# Altium schematic sheet IO MAPPING - Pin Map.SchDoc: IO MAPPING - Pin Map and switches
size A3; Organization: Tekt Industries; DocumentNumber: 2; Revision: A.01; SheetNumber: 2; SheetTotal: 3; ApprovedBy: M J Adams; CheckedBy: M J Adams; Author: M J Adams; CompanyName: Tekt Industries; DrawnBy: M J Adams; Engineer: M J Adams; DocumentSize: A3; ProjectTitle: CODE OF CONSCIENCE
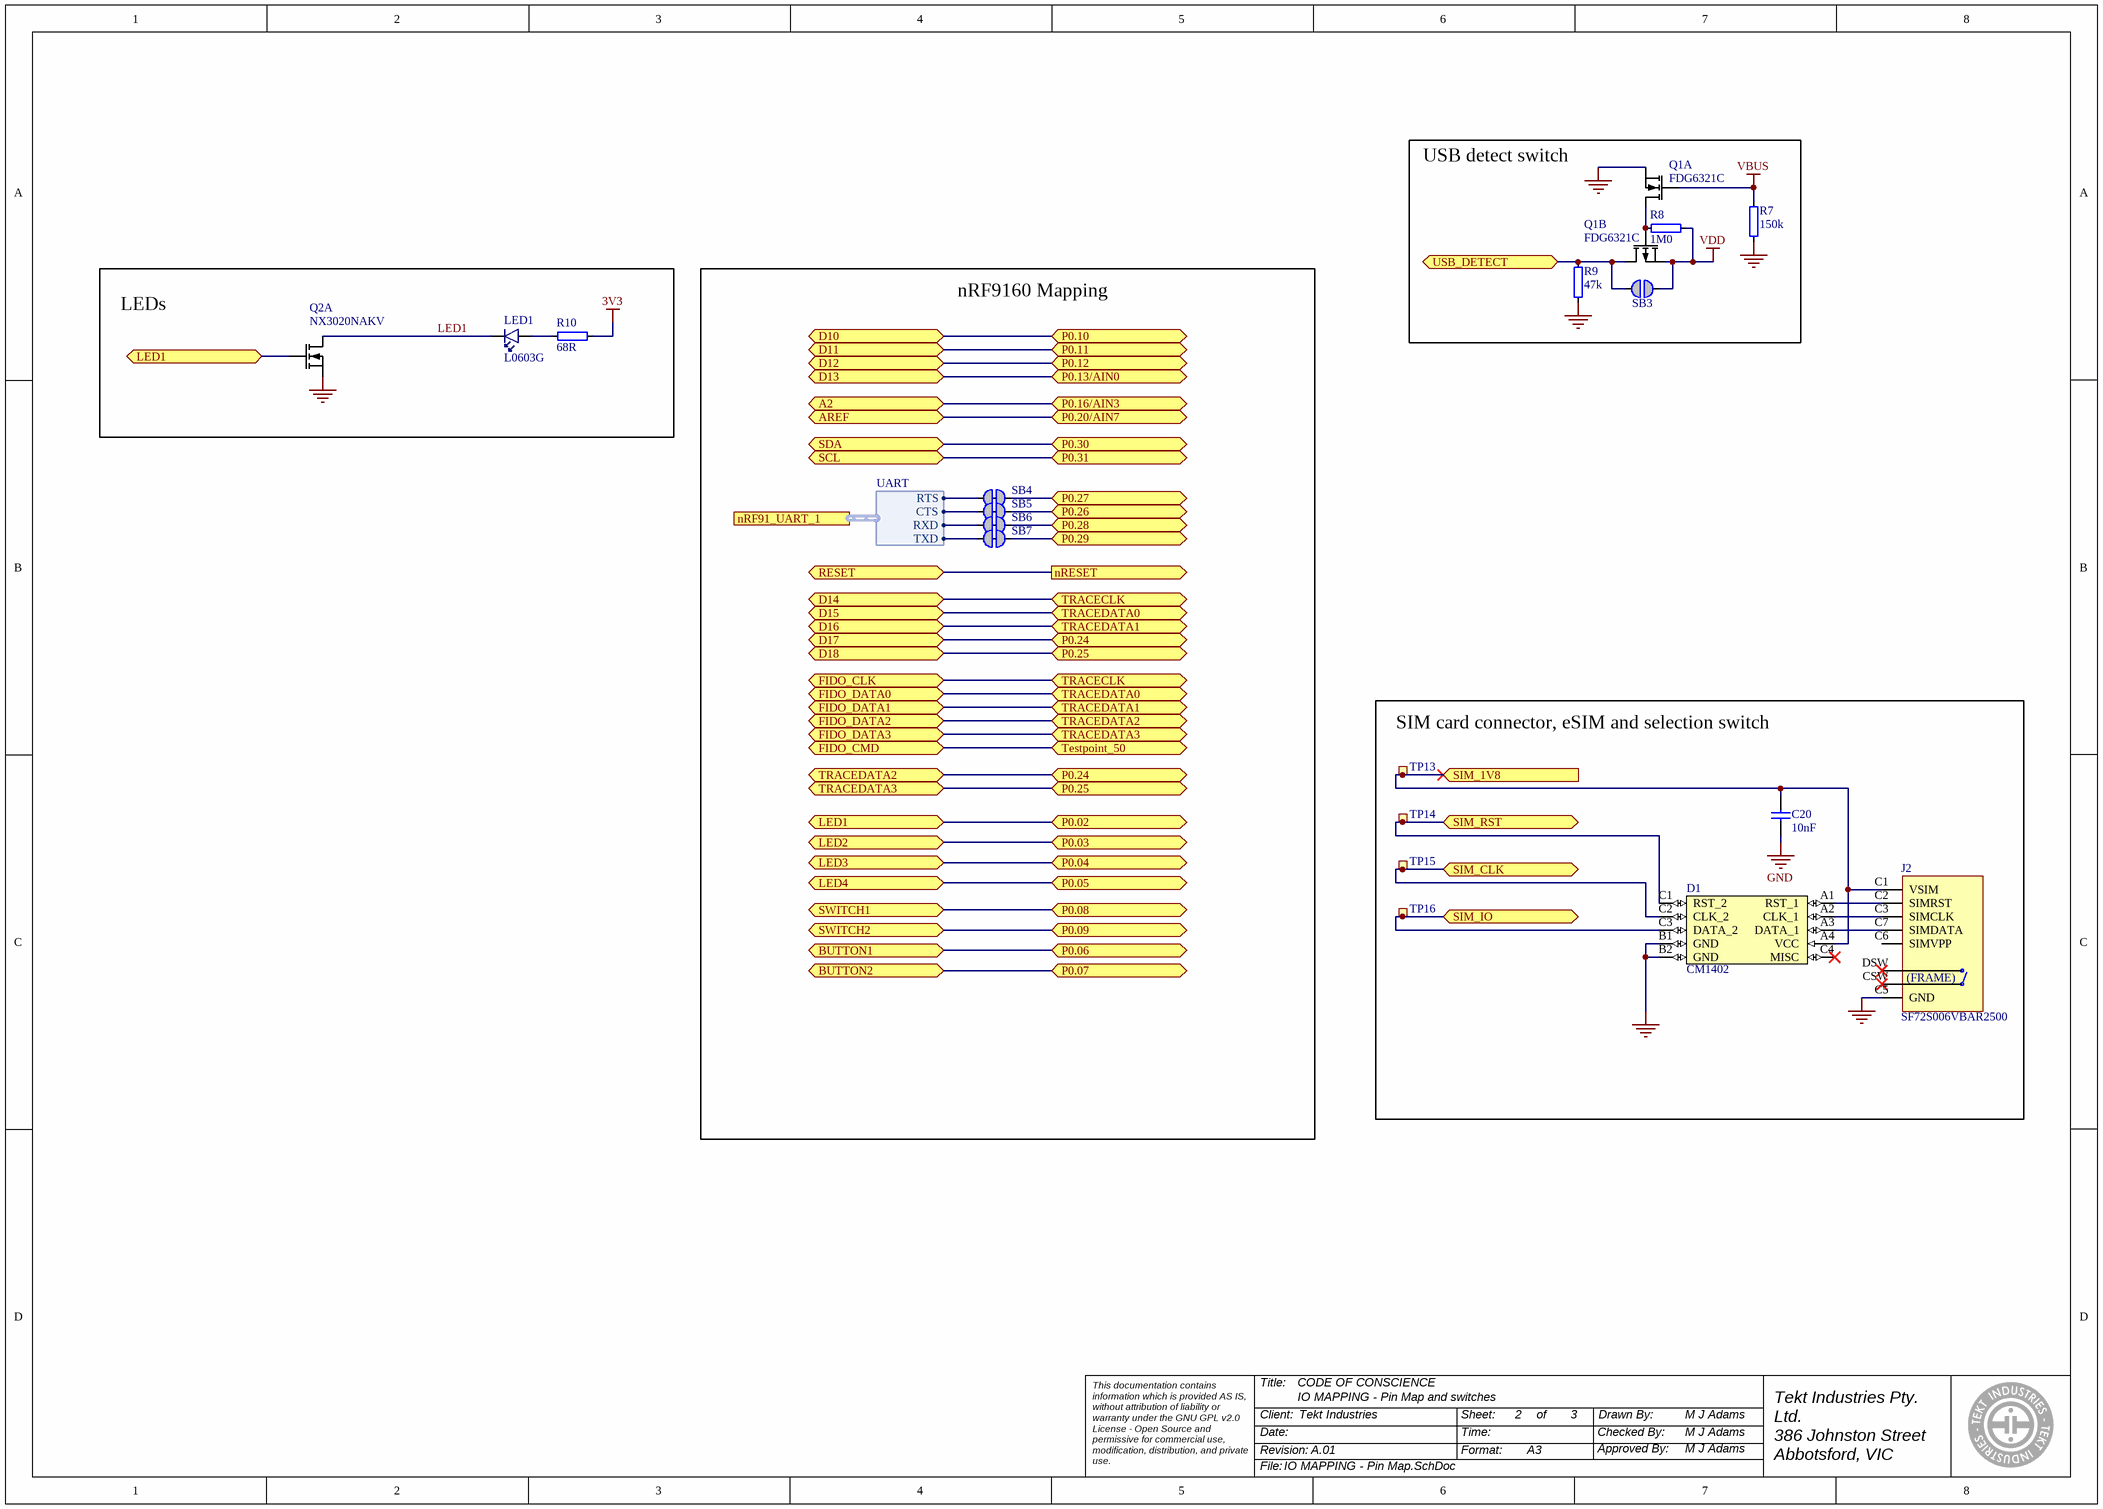
[diagram p0: IO MAPPING - Pin Map.SchDoc]

## Parts
C20  10nF  [CAPC0603X03L_C]
D1  CM1402  [CM1402]
J2  SF72S006VBAR2500  [SF72S006VBAR2500]
LED1  L0603G  [LED_0603_G]
Q1  FDG6321C  [SOT65P210X100-6N]  (parts A,B of 2)
Q2  NX3020NAKV  [NX3020NAKV]  (part A of 2)
R7  150k  [RESC0603X03L_C]
R8  1M0  [RESC0603X03L_C]
R9  47k  [RESC0603X03L_C]
R10  68R  [RESC0603X03L_C]
SB3  Solderbridge  [Solderbridge]  (value not drawn)  (no BOM)
SB4  Solderbridge  [Solderbridge_Shorted]  (value not drawn)  (net tie, no BOM)
SB5  Solderbridge  [Solderbridge_Shorted]  (value not drawn)  (net tie, no BOM)
SB6  Solderbridge  [Solderbridge_Shorted]  (value not drawn)  (net tie, no BOM)
SB7  Solderbridge  [Solderbridge_Shorted]  (value not drawn)  (net tie, no BOM)
TP13  Ø1.5mm,SMD  [TP_SMD_Ø1.5mm]  (value not drawn)  (no BOM)
TP14  Ø1.5mm,SMD  [TP_SMD_Ø1.5mm]  (value not drawn)  (no BOM)
TP15  Ø1.5mm,SMD  [TP_SMD_Ø1.5mm]  (value not drawn)  (no BOM)
TP16  Ø1.5mm,SMD  [TP_SMD_Ø1.5mm]  (value not drawn)  (no BOM)

## Blocks framed on the sheet
USB detect switch: Q1 R7-R9 SB3
LEDs: LED1 Q2 R10
nRF9160 Mapping: SB4-SB7
SIM card connector, eSIM and selection switch: C20 D1 J2 TP13-TP16

## Ports
A2 (bidir), AREF (bidir), BUTTON1 (bidir), BUTTON2 (bidir), D10 (bidir), D11 (bidir), D12 (bidir), D13 (bidir), D14 (bidir), D15 (bidir), D16 (bidir), D17 (bidir), D18 (bidir), FIDO_CLK (bidir), FIDO_CMD (bidir), FIDO_DATA0 (bidir), FIDO_DATA1 (bidir), FIDO_DATA2 (bidir), FIDO_DATA3 (bidir), LED1 (bidir), LED2 (bidir), LED3 (bidir), LED4 (bidir), nRESET (out), nRF91_UART_1 (harness UART), P0.02 (bidir), P0.03 (bidir), P0.04 (bidir), P0.05 (bidir), P0.06 (bidir), P0.07 (bidir), P0.08 (bidir), P0.09 (bidir), P0.10 (bidir), P0.11 (bidir), P0.12 (bidir), P0.13/AIN0 (bidir), P0.16/AIN3 (bidir), P0.20/AIN7 (bidir), P0.24 (bidir), P0.25 (bidir), P0.26 (bidir), P0.27 (bidir), P0.28 (bidir), P0.29 (bidir), P0.30 (bidir), P0.31 (bidir), RESET (bidir), SCL (bidir), SDA (bidir), SIM_1V8 (in), SIM_CLK (bidir), SIM_IO (bidir), SIM_RST (bidir), SWITCH1 (bidir), SWITCH2 (bidir), Testpoint_50 (bidir), TRACECLK (bidir), TRACEDATA0 (bidir), TRACEDATA1 (bidir), TRACEDATA2 (bidir), TRACEDATA3 (bidir), USB_DETECT (bidir)

## Harnesses
UART: RTS, CTS, RXD, TXD

## Nets
3V3: R10.2
GND: C20.2 D1.B1(GND) D1.B2(GND) J2.0(GND) J2.C5(GND) Q1.1(S1) Q2.1(S1) R7.1 R9.1
VBUS: Q1.2(G1) R7.2
VDD: Q1.4(S2) R8.1 SB3.1
A2: port P0.16/AIN3, port A2
AREF: port AREF, port P0.20/AIN7
BUTTON1: port BUTTON1, port P0.06
BUTTON2: port BUTTON2, port P0.07
D10: port P0.10, port D10
D11: port P0.11, port D11
D12: port P0.12, port D12
D13: port P0.13/AIN0, port D13
D14: port D14, port FIDO_CLK, port TRACECLK
D15: port D15, port FIDO_DATA0, port TRACEDATA0
D16: port D16, port FIDO_DATA1, port TRACEDATA1
D17: port P0.24, port D17, port FIDO_DATA2, port TRACEDATA2
D18: port P0.25, port D18, port FIDO_DATA3, port TRACEDATA3
FIDO_CMD: port FIDO_CMD, port Testpoint_50
LED1: LED1.1(C) Q2.6(D1)
LED1: Q2.2(G1) ; port LED1, port P0.02  [a separate net that carries the same name]
LED2: port LED2, port P0.03
LED3: port LED3, port P0.04
LED4: port LED4, port P0.05
nRESET: port RESET, port nRESET
P0.08: port SWITCH1, port P0.08
P0.09: port SWITCH2, port P0.09
P0.26: SB5.1 ; port P0.26
P0.27: SB4.1 ; port P0.27
P0.28: SB6.1 ; port P0.28
P0.29: SB7.1 ; port P0.29
P0.30: port SDA, port P0.30
P0.31: port SCL, port P0.31
SIM_1V8: C20.1 D1.A4(VCC) J2.C1(VSIM) TP13.1 ; port SIM_1V8
SIM_CLK: D1.C2(CLK_2) TP15.1 ; port SIM_CLK
SIM_IO: D1.C3(DATA_2) TP16.1 ; port SIM_IO
SIM_RST: D1.C1(RST_2) TP14.1 ; port SIM_RST
USB_DETECT: Q1.3(D2) R9.2 SB3.2 ; port USB_DETECT
NetD1_A1: D1.A1(RST_1) J2.C2(SIMRST)
NetD1_A2: D1.A2(CLK_1) J2.C3(SIMCLK)
NetD1_A3: D1.A3(DATA_1) J2.C7(SIMDATA)
NetLED1_2: LED1.2(A) R10.1
NetQ1_5: Q1.5(G2) Q1.6(D1) R8.2
NetSB4_2: SB4.2 ; port nRF91_UART_1.RTS
NetSB5_2: SB5.2 ; port nRF91_UART_1.CTS
NetSB6_2: SB6.2 ; port nRF91_UART_1.RXD
NetSB7_2: SB7.2 ; port nRF91_UART_1.TXD

Not connected (* = marked no-connect by the designer): D1 C4(MISC)*; J2 C6(SIMVPP) CSW* DSW*

## Notes on the sheet
- Title:
- Date:
- Revision:
- Client:
- Sheet:
- Time:
- Format:
- A3
- of
- Checked By:
- Approved By:
- Drawn By:
- Tekt Industries Pty. Ltd.
  386 Johnston Street
  Abbotsford, VIC
  Australia, 3067
- This documentation contains information which is provided AS IS, without attribution of liability or warranty under the GNU GPL v2.0 License - Open Source and permissive for commercial use, modification, distribution, and private use.
- File:
- (in symbol SF72S006VBAR2500) (FRAME)

## Library data of the parts
C20 = C0201-10n: Capacitor, X7R, ±10%; Manufacturer: Murata Electronics North America; Manufacturer Part No.: GRM033R61E103KA12D; Part number IPS: 00000003480; Note: 10V; Artikkelnr Noca: N.A.; Part Number: C0201-10n; ComponentLink1URL: *; ComponentLink1Description: Datasheet; ComponentLink2URL: *; ComponentLink2Description: Supplier link; HelpURL: *; Footprint Doc: 0201; LatestRevisionDate: 2017-11-09; Pin Count: 2; Publisher: Nordic Semiconductor; Published: 2014-11-13; Value: 10nF; Supplier: Digi-Key; Supplier Part No.: 490-7194-1-ND; Supplier 2: *; Supplier Part Number 2: *
D1 = CM1402: EMI Network Filter Arrays SIM CARD EMI FILTER WITH ESD PROTECTION; Manufacturer: ON Semiconductor; Manufacturer Part No.: CM1402-03CP; Artikkelnr Noca: N.A.; Part Number: CM1402; Footprint Doc: CM1402; LatestRevisionDate: 2017-02-06; Publisher: Nordic Semiconductor; Published: 2017-02-06; Value: CM1402; Note: *; ComponentLink1URL: *; ComponentLink1Description: Datasheet; ComponentLink2URL: *; ComponentLink2Description: Supplier link; HelpURL: http://www.onsemi.com/pub_link/Collateral/CM1402-D.PDF; Pin Count: 10; Supplier: Digi-Key; Supplier Part No.: CM1402-03CPOSTR-ND; Supplier 2: Mouser; Supplier Part Number 2: 748-CM1402-03CP; Part number IPS: N.A.
J2 = SF72S006VBAR2500: n 8 (6 + 2) Position Card Connector NANO SIM Surface Mount, Right Angle Gold; Manufacturer: JAE; Artikkelnr Noca: N.A.; Part Number: SF72S006VBAR2500; Manufacturer Part No.: SF72S006VBAR2500; Footprint Doc: SF72S006VBAR2500; LatestRevisionDate: 2016-09-09; Pin Count: 8; Publisher: Nordic Semiconductor; Published: 2016-09-09; Value: SF72S006VBAR2500; Note: *; Part number IPS: N.A.; ComponentLink1URL: *; ComponentLink1Description: Datasheet; ComponentLink2URL: *; ComponentLink2Description: Supplier link; HelpURL: http://jae-connectors.com/en/pdf/MB-0282-1E_SF72.pdf; Supplier: Digi-Key; Supplier Part No.: 670-2799-1-ND; Supplier 2: Mouser; Supplier Part Number 2: 656-SF72S006VBAR2500
LED1 = LG L29K Smartled Green: LED, Green, 0603, 570nm, Vf=1.7V, 2.24..5.6mcd, - 40 to +100°C; Manufacturer: Osram; Manufacturer Part No.: LG L29K-G2J1-24-Z; Part number IPS: N.A.; Note: 2.24..5.6 mcd, Vfmin=1.7V; Artikkelnr Noca: 13019147; Part Number: LG L29K Smartled Green; Footprint Doc: 0603; LatestRevisionDate: 2017-08-21; Pin Count: 2; Publisher: Nordic Semiconductor; Published: 2014-10-28; Value: L0603G; ComponentLink1URL: *; ComponentLink1Description: Datasheet; ComponentLink2URL: *; ComponentLink2Description: Supplier link; HelpURL: http://www.osram-os.com/Graphics/XPic2/00077107_0.pdf; Supplier: Digi-Key; Supplier Part No.: 475-2709-1-ND; Supplier 2: Mouser; Supplier Part Number 2: 720-LGL29KG2J124Z
Q1 = FDG6321C: Fairchild, FDG6321C, Dual N & P Channel Digital FET; Part number IPS: N.A.; Artikkelnr Noca: 35029089; Part Number: FDG6321C; Manufacturer: Fairchild; Manufacturer Part No.: FDG6321C; LatestRevisionDate: 2011-05-11; Pin Count: 6; Publisher: Nordic Semiconductor; Published: 2009-09-16; Value: FDG6321C; Note: Dual N & P Channel Digital FET; Footprint Doc: SC70-6; ComponentLink1URL: *; ComponentLink1Description: Datasheet; ComponentLink2URL: *; ComponentLink2Description: Supplier link; HelpURL: http://www.fairchildsemi.com/ds/FD/FDG6321C.pdf; Supplier: Digi-Key; Supplier Part No.: FDG6321CCT-ND; Supplier 2: Digi-Key; Supplier Part Number 2: FDG6321CCT-ND
Q2 = NX3020NAKV: MOSFET 2N-CH 30V 0.2A SOT666; Manufacturer: Nexperia; Manufacturer Part No.: NX3020NAKV,115; Artikkelnr Noca: N.A.; Part Number: NX3020NAKV; ComponentLink1URL: https://assets.nexperia.com/documents/data-sheet/NX3020NAKV.pdf; ComponentLink1Description: Datasheet; ComponentLink2URL: *; ComponentLink2Description: Supplier link; HelpURL: *; Footprint Doc: SOT666; LatestRevisionDate: 2018-12-13; Pin Count: 6; Publisher: Nordic Semiconductor; Published: 2018-12-13; Value: NX3020NAKV; Note: *; Supplier: Digi-Key; Supplier Part No.: 1727-1287-2-ND; Supplier 2: Mouser; Supplier Part Number 2: 771-NX3020NAKV115; Part number IPS: N.A.
R7 = R0201-150k: Resistor, ±1%, 0.05W; Manufacturer: Stackpole Electronics Inc; Manufacturer Part No.: RMCF0201FT150K; Note: Chip Res 1%; Artikkelnr Noca: N.A.; Part Number: R0201-150k; ComponentLink1URL: *; ComponentLink1Description: Datasheet; ComponentLink2URL: *; ComponentLink2Description: Supplier link; HelpURL: *; Footprint Doc: 0201; LatestRevisionDate: 2014-11-13; Pin Count: 2; Publisher: Nordic Semiconductor; Published: 2014-11-13; Value: 150k; Part number IPS: N.A.; Supplier: Digi-Key; Supplier Part No.: RMCF0201FT150KCT-ND; Supplier 2: *; Supplier Part Number 2: *
R8 = R0201-1M0: Resistor, ±1%, 0.05W; Manufacturer: Yageo; Manufacturer Part No.: RC0201FR-071ML; Note: Chip Res 1%; Artikkelnr Noca: N.A.; Part Number: R0201-1M0; ComponentLink1URL: *; ComponentLink1Description: Datasheet; ComponentLink2URL: *; ComponentLink2Description: Supplier link; HelpURL: *; Footprint Doc: 0201; LatestRevisionDate: 2014-11-13; Pin Count: 2; Publisher: Nordic Semiconductor; Published: 2014-11-13; Value: 1M0; Part number IPS: N.A.; Supplier: Digi-Key; Supplier Part No.: 311-1MMCT-ND; Supplier 2: *; Supplier Part Number 2: *
R9 = R0201-47k: Resistor, ±1%, 0.05W; Manufacturer: Samsung Electro-Mechanics; Manufacturer Part No.: RC0603F473CS; Note: Chip Res 1%; Artikkelnr Noca: N.A.; Part Number: R0201-47k; ComponentLink1URL: *; ComponentLink1Description: Datasheet; ComponentLink2URL: *; ComponentLink2Description: Supplier link; HelpURL: *; Footprint Doc: 0201; LatestRevisionDate: 2014-11-13; Pin Count: 2; Publisher: Nordic Semiconductor; Published: 2014-11-13; Value: 47k; Part number IPS: N.A.; Supplier: Digi-Key; Supplier Part No.: 1276-3701-1-ND; Supplier 2: *; Supplier Part Number 2: *
R10 = R0201-68R: Resistor, ±1%, 0.05W; Manufacturer: Yageo; Manufacturer Part No.: RC0201FR-0768RL; Note: Chip Res 1%; Artikkelnr Noca: N.A.; Part Number: R0201-68R; ComponentLink1URL: *; ComponentLink1Description: Datasheet; ComponentLink2URL: *; ComponentLink2Description: Supplier link; HelpURL: *; Footprint Doc: 0201; LatestRevisionDate: 2014-11-13; Pin Count: 2; Publisher: Nordic Semiconductor; Published: 2014-11-13; Value: 68R; Supplier: Digi-Key; Supplier Part No.: YAG2773CT-ND; Supplier 2: *; Supplier Part Number 2: *; Part number IPS: N.A.
SB3 = Solderbridge: Artikkelnr Noca: N.A.; Part Number: Solderbridge; LatestRevisionDate: 2009-12-14; Pin Count: 2; Publisher: Nordic Semiconductor; Published: 2009-12-14; Value: Solderbridge; Note: *; Footprint Doc: Solderbridge; Part number IPS: N.A.; ComponentLink1URL: *; ComponentLink1Description: Datasheet; ComponentLink2URL: *; ComponentLink2Description: Supplier link; HelpURL: *; Supplier Part No.: *; Supplier 2: *
SB4-SB7 = Solderbridge Shorted: Shorted Solderbridge; Artikkelnr Noca: N.A.; Part Number: Solderbridge Shorted; Footprint Doc: Solderbridge_Shorted; LatestRevisionDate: 2012-08-07; Pin Count: 2; Publisher: Nordic Semiconductor; Published: 2012-08-07; Value: Solderbridge; Note: *; Part number IPS: N.A.; ComponentLink1URL: *; ComponentLink1Description: Datasheet; ComponentLink2URL: *; ComponentLink2Description: Supplier link; HelpURL: *; Supplier Part No.: *; Supplier 2: *
TP13-TP16 = TP_SMD_Ø1.5MM: 1.0mm circular SMD testpad; Artikkelnr Noca: N.A.; Part Number: TP_SMD_Ø1.5MM; ComponentLink1URL: *; ComponentLink1Description: Datasheet; ComponentLink2URL: *; ComponentLink2Description: Supplier link; HelpURL: *; Footprint Doc: TP_SMD_Ø1.5mm; LatestRevisionDate: 2016-06-02; Pin Count: 1; Publisher: Nordic Semiconductor; Published: 2016-06-02; Value: Ø1.5mm,SMD; Note: *; Part number IPS: N.A.; Supplier Part No.: *; Supplier 2: *